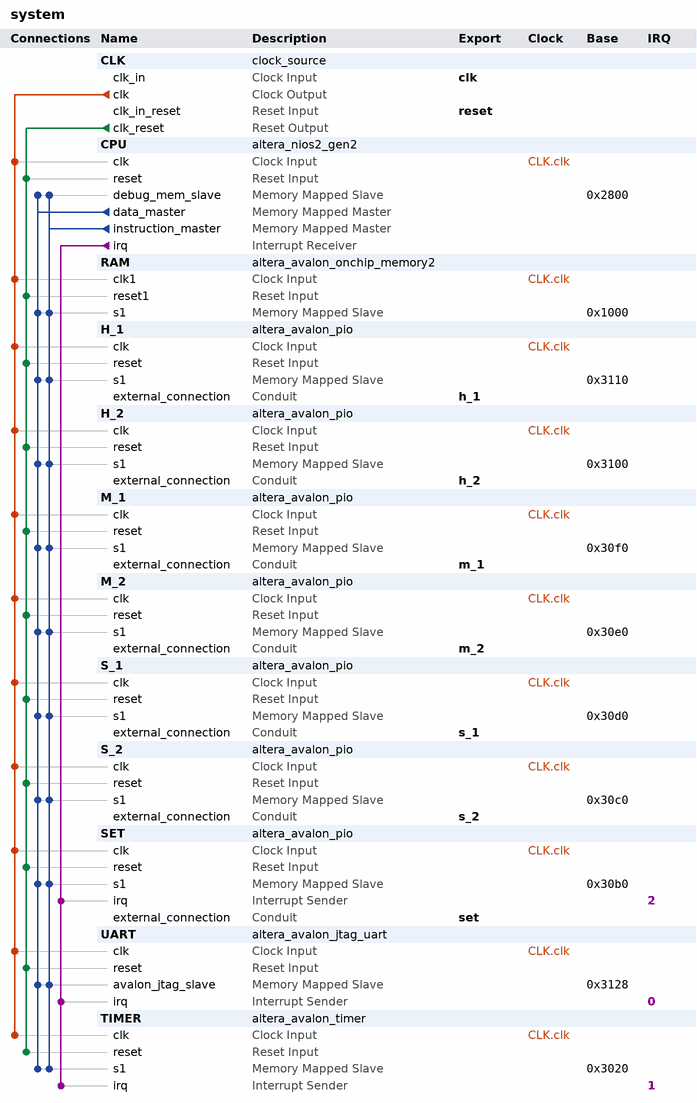
[diagram p0: system contents]
# Platform Designer (Qsys) system system, Cyclone V 5CEBA2F17A7
# Parameters at their usual value, and those the tool derives, are not listed.
package require -exact qsys 18.1
create_system system
set_project_property DEVICE_FAMILY {Cyclone V}
set_project_property DEVICE 5CEBA2F17A7

add_instance CLK clock_source 18.1
set_instance_parameter_value CLK clockFrequency 50000000

add_instance CPU altera_nios2_gen2 18.1
set_instance_parameter_value CPU dcache_size 2048
set_instance_parameter_value CPU exceptionSlave RAM.s1
set_instance_parameter_value CPU icache_size 4096
set_instance_parameter_value CPU impl Tiny
set_instance_parameter_value CPU resetSlave RAM.s1

add_instance RAM altera_avalon_onchip_memory2 18.1
set_instance_parameter_value RAM dataWidth 32
set_instance_parameter_value RAM dualPort false
set_instance_parameter_value RAM initMemContent true
set_instance_parameter_value RAM initializationFileName onchip_mem.hex
set_instance_parameter_value RAM memorySize 4096

add_instance H_1 altera_avalon_pio 18.1
set_instance_parameter_value H_1 direction Output
set_instance_parameter_value H_1 width 4

add_instance H_2 altera_avalon_pio 18.1
set_instance_parameter_value H_2 direction Output
set_instance_parameter_value H_2 width 4

add_instance M_1 altera_avalon_pio 18.1
set_instance_parameter_value M_1 direction Output
set_instance_parameter_value M_1 width 4

add_instance M_2 altera_avalon_pio 18.1
set_instance_parameter_value M_2 direction Output
set_instance_parameter_value M_2 width 4

add_instance S_1 altera_avalon_pio 18.1
set_instance_parameter_value S_1 direction Output
set_instance_parameter_value S_1 width 4

add_instance S_2 altera_avalon_pio 18.1
set_instance_parameter_value S_2 direction Output
set_instance_parameter_value S_2 width 4

add_instance SET altera_avalon_pio 18.1
set_instance_parameter_value SET direction Input
set_instance_parameter_value SET generateIRQ true
set_instance_parameter_value SET width 5

add_instance UART altera_avalon_jtag_uart 18.1
set_instance_parameter_value UART simInteractiveOptions NO_INTERACTIVE_WINDOWS

add_instance TIMER altera_avalon_timer 18.1
set_instance_parameter_value TIMER period 1
set_instance_parameter_value TIMER periodUnits MSEC
set_instance_parameter_value TIMER snapshot false

# connections
add_connection CLK.clk CPU.clk clock
add_connection CLK.clk H_1.clk clock
add_connection CLK.clk H_2.clk clock
add_connection CLK.clk M_1.clk clock
add_connection CLK.clk M_2.clk clock
add_connection CLK.clk RAM.clk1 clock
add_connection CLK.clk S_1.clk clock
add_connection CLK.clk S_2.clk clock
add_connection CLK.clk SET.clk clock
add_connection CLK.clk TIMER.clk clock
add_connection CLK.clk UART.clk clock
add_connection CLK.clk_reset CPU.reset reset
add_connection CLK.clk_reset H_1.reset reset
add_connection CLK.clk_reset H_2.reset reset
add_connection CLK.clk_reset M_1.reset reset
add_connection CLK.clk_reset M_2.reset reset
add_connection CLK.clk_reset RAM.reset1 reset
add_connection CLK.clk_reset S_1.reset reset
add_connection CLK.clk_reset S_2.reset reset
add_connection CLK.clk_reset SET.reset reset
add_connection CLK.clk_reset TIMER.reset reset
add_connection CLK.clk_reset UART.reset reset
add_connection CPU.data_master CPU.debug_mem_slave avalon
set_connection_parameter_value CPU.data_master/CPU.debug_mem_slave baseAddress 0x2800
add_connection CPU.data_master H_1.s1 avalon
set_connection_parameter_value CPU.data_master/H_1.s1 baseAddress 0x3110
add_connection CPU.data_master H_2.s1 avalon
set_connection_parameter_value CPU.data_master/H_2.s1 baseAddress 0x3100
add_connection CPU.data_master M_1.s1 avalon
set_connection_parameter_value CPU.data_master/M_1.s1 baseAddress 0x30f0
add_connection CPU.data_master M_2.s1 avalon
set_connection_parameter_value CPU.data_master/M_2.s1 baseAddress 0x30e0
add_connection CPU.data_master RAM.s1 avalon
set_connection_parameter_value CPU.data_master/RAM.s1 baseAddress 0x1000
add_connection CPU.data_master S_1.s1 avalon
set_connection_parameter_value CPU.data_master/S_1.s1 baseAddress 0x30d0
add_connection CPU.data_master S_2.s1 avalon
set_connection_parameter_value CPU.data_master/S_2.s1 baseAddress 0x30c0
add_connection CPU.data_master SET.s1 avalon
set_connection_parameter_value CPU.data_master/SET.s1 baseAddress 0x30b0
add_connection CPU.data_master TIMER.s1 avalon
set_connection_parameter_value CPU.data_master/TIMER.s1 baseAddress 0x3020
add_connection CPU.data_master UART.avalon_jtag_slave avalon
set_connection_parameter_value CPU.data_master/UART.avalon_jtag_slave baseAddress 0x3128
add_connection CPU.instruction_master CPU.debug_mem_slave avalon
set_connection_parameter_value CPU.instruction_master/CPU.debug_mem_slave baseAddress 0x2800
add_connection CPU.instruction_master H_1.s1 avalon
set_connection_parameter_value CPU.instruction_master/H_1.s1 baseAddress 0x3110
add_connection CPU.instruction_master H_2.s1 avalon
set_connection_parameter_value CPU.instruction_master/H_2.s1 baseAddress 0x3100
add_connection CPU.instruction_master M_1.s1 avalon
set_connection_parameter_value CPU.instruction_master/M_1.s1 baseAddress 0x30f0
add_connection CPU.instruction_master M_2.s1 avalon
set_connection_parameter_value CPU.instruction_master/M_2.s1 baseAddress 0x30e0
add_connection CPU.instruction_master RAM.s1 avalon
set_connection_parameter_value CPU.instruction_master/RAM.s1 baseAddress 0x1000
add_connection CPU.instruction_master S_1.s1 avalon
set_connection_parameter_value CPU.instruction_master/S_1.s1 baseAddress 0x30d0
add_connection CPU.instruction_master S_2.s1 avalon
set_connection_parameter_value CPU.instruction_master/S_2.s1 baseAddress 0x30c0
add_connection CPU.instruction_master SET.s1 avalon
set_connection_parameter_value CPU.instruction_master/SET.s1 baseAddress 0x30b0
add_connection CPU.instruction_master TIMER.s1 avalon
set_connection_parameter_value CPU.instruction_master/TIMER.s1 baseAddress 0x3020
add_connection CPU.instruction_master UART.avalon_jtag_slave avalon
set_connection_parameter_value CPU.instruction_master/UART.avalon_jtag_slave baseAddress 0x3128
add_connection CPU.irq SET.irq interrupt
set_connection_parameter_value CPU.irq/SET.irq irqNumber 2
add_connection CPU.irq TIMER.irq interrupt
set_connection_parameter_value CPU.irq/TIMER.irq irqNumber 1
add_connection CPU.irq UART.irq interrupt
set_connection_parameter_value CPU.irq/UART.irq irqNumber 0

# exported interfaces
add_interface clk clock sink
set_interface_property clk EXPORT_OF CLK.clk_in
add_interface h_1 conduit end
set_interface_property h_1 EXPORT_OF H_1.external_connection
add_interface h_2 conduit end
set_interface_property h_2 EXPORT_OF H_2.external_connection
add_interface m_1 conduit end
set_interface_property m_1 EXPORT_OF M_1.external_connection
add_interface m_2 conduit end
set_interface_property m_2 EXPORT_OF M_2.external_connection
add_interface reset reset sink
set_interface_property reset EXPORT_OF CLK.clk_in_reset
add_interface s_1 conduit end
set_interface_property s_1 EXPORT_OF S_1.external_connection
add_interface s_2 conduit end
set_interface_property s_2 EXPORT_OF S_2.external_connection
add_interface set conduit end
set_interface_property set EXPORT_OF SET.external_connection

set_interconnect_requirement {$system} qsys_mm.clockCrossingAdapter HANDSHAKE
set_interconnect_requirement {$system} qsys_mm.enableEccProtection FALSE
set_interconnect_requirement {$system} qsys_mm.insertDefaultSlave FALSE
set_interconnect_requirement {$system} qsys_mm.maxAdditionalLatency 1

save_system system.qsys
